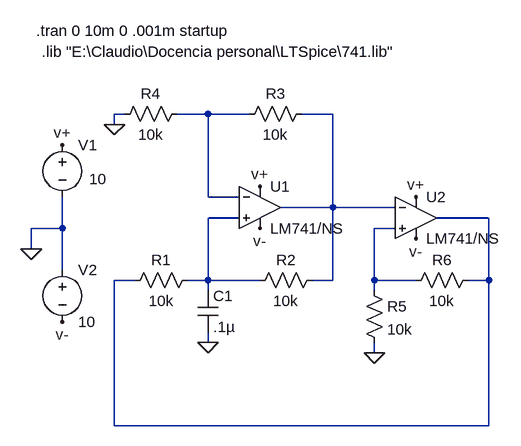
[diagram p0: schematic cuadrada_triangular.asc]
cuadrada_triangular.asc, the LTspice schematic file:
Version 4
SHEET 1 880 680
WIRE -160 0 -176 0
WIRE -32 0 -80 0
WIRE 32 0 -32 0
WIRE 160 0 112 0
WIRE -176 16 -176 0
WIRE -32 128 -32 0
WIRE 16 128 -32 128
WIRE 160 144 160 0
WIRE 160 144 80 144
WIRE 256 144 160 144
WIRE 16 160 -32 160
WIRE 400 160 320 160
WIRE -256 176 -256 128
WIRE -256 176 -304 176
WIRE 256 176 224 176
WIRE -304 208 -304 176
WIRE -256 240 -256 176
WIRE -144 256 -176 256
WIRE -32 256 -32 160
WIRE -32 256 -64 256
WIRE 48 256 -32 256
WIRE 160 256 160 144
WIRE 160 256 128 256
WIRE 224 256 224 176
WIRE 288 256 224 256
WIRE 400 256 400 160
WIRE 400 256 368 256
WIRE -32 272 -32 256
WIRE 224 272 224 256
WIRE -32 352 -32 336
WIRE 224 368 224 352
WIRE -176 480 -176 256
WIRE 400 480 400 256
WIRE 400 480 -176 480
FLAG -304 208 0
FLAG -256 48 v+
FLAG 48 112 v+
FLAG 288 128 v+
FLAG -256 320 v-
FLAG 48 176 v-
FLAG 288 192 v-
FLAG -32 352 0
FLAG -176 16 0
FLAG 224 368 0
SYMBOL voltage -256 32 R0
WINDOW 123 0 0 Left 2
WINDOW 39 0 0 Left 2
WINDOW 3 41 68 Left 2
SYMATTR Value 10
SYMATTR InstName V1
SYMBOL voltage -256 224 R0
WINDOW 123 0 0 Left 2
WINDOW 39 0 0 Left 2
SYMATTR InstName V2
SYMATTR Value 10
SYMBOL cap -48 272 R0
SYMATTR InstName C1
SYMATTR Value .1µ
SYMBOL res -48 240 R90
WINDOW 0 0 56 VBottom 2
WINDOW 3 32 56 VTop 2
SYMATTR InstName R1
SYMATTR Value 10k
SYMBOL res 144 240 R90
WINDOW 0 0 56 VBottom 2
WINDOW 3 32 56 VTop 2
SYMATTR InstName R2
SYMATTR Value 10k
SYMBOL res 128 -16 R90
WINDOW 0 0 56 VBottom 2
WINDOW 3 32 56 VTop 2
SYMATTR InstName R3
SYMATTR Value 10k
SYMBOL res -64 -16 R90
WINDOW 0 0 56 VBottom 2
WINDOW 3 32 56 VTop 2
SYMATTR InstName R4
SYMATTR Value 10k
SYMBOL res 208 256 R0
SYMATTR InstName R5
SYMATTR Value 10k
SYMBOL res 384 240 R90
WINDOW 0 0 56 VBottom 2
WINDOW 3 32 56 VTop 2
SYMATTR InstName R6
SYMATTR Value 10k
SYMBOL OpAmps\\opamp2 48 80 R0
SYMATTR InstName U1
SYMATTR Value LM741/NS
SYMBOL OpAmps\\opamp2 288 96 R0
SYMATTR InstName U2
SYMATTR Value LM741/NS
TEXT -296 -128 Left 2 !.tran 0 10m 0 .001m startup
TEXT -288 -96 Left 2 !.lib "E:\\Claudio\\Docencia personal\\LTSpice\\741.lib"

The netlist it stands for:
* cuadrada_triangular.asc
V1 v+ 0 10
V2 0 v- 10
C1 N003 0 .1µ
R1 N003 N004 10k
R2 N002 N003 10k
R3 N002 N001 10k
R4 N001 0 10k
R5 N005 0 10k
R6 N004 N005 10k
XU1 N003 N001 v+ v- N002 LM741/NS  ; pins In+ In- V+ V- OUT
XU2 N005 N002 v+ v- N004 LM741/NS  ; pins In+ In- V+ V- OUT
.tran 0 10m 0 .001m startup
.lib "E:\Claudio\Docencia personal\LTSpice\741.lib"
.backanno
.end